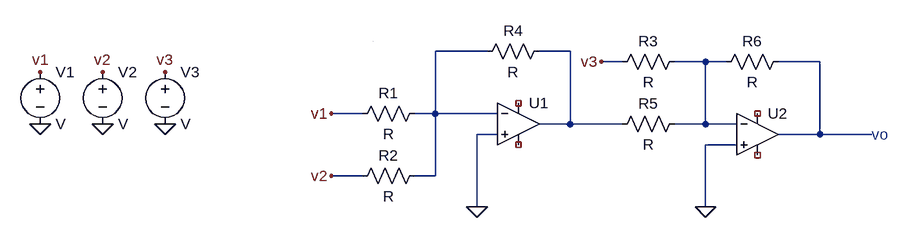
[diagram p0: schematic Q1 blank.asc]
Q1 blank.asc, the LTspice schematic file:
Version 4.1
SHEET 1 880 680
WIRE 176 16 96 16
WIRE 304 16 256 16
WIRE 384 32 352 32
WIRE 512 32 464 32
WIRE 544 32 512 32
WIRE 688 32 624 32
WIRE -16 112 -64 112
WIRE 96 112 96 16
WIRE 96 112 64 112
WIRE 192 112 96 112
WIRE 304 128 304 16
WIRE 304 128 256 128
WIRE 384 128 304 128
WIRE 512 128 512 32
WIRE 512 128 464 128
WIRE 560 128 512 128
WIRE 192 144 160 144
WIRE 688 144 688 32
WIRE 688 144 624 144
WIRE 768 144 688 144
WIRE 560 160 512 160
WIRE -16 208 -64 208
WIRE 96 208 96 112
WIRE 96 208 64 208
WIRE 160 256 160 144
WIRE 512 256 512 160
WIRE 0 0 0 0
FLAG -320 128 0
FLAG -416 128 0
FLAG -512 128 0
FLAG -512 48 v1
FLAG -64 112 v1
FLAG -416 48 v2
FLAG -64 208 v2
FLAG -320 48 v3
FLAG 352 32 v3
FLAG 160 256 0
FLAG 512 256 0
SYMBOL res 80 96 R90
WINDOW 0 0 56 VBottom 2
WINDOW 3 32 56 VTop 2
SYMATTR InstName R1
SYMBOL res 80 192 R90
WINDOW 0 0 56 VBottom 2
WINDOW 3 32 56 VTop 2
SYMATTR InstName R2
SYMBOL res 480 16 R90
WINDOW 0 0 56 VBottom 2
WINDOW 3 32 56 VTop 2
SYMATTR InstName R3
SYMBOL res 272 0 R90
WINDOW 0 0 56 VBottom 2
WINDOW 3 32 56 VTop 2
SYMATTR InstName R4
SYMBOL res 480 112 R90
WINDOW 0 0 56 VBottom 2
WINDOW 3 32 56 VTop 2
SYMATTR InstName R5
SYMBOL res 640 16 R90
WINDOW 0 0 56 VBottom 2
WINDOW 3 32 56 VTop 2
SYMATTR InstName R6
SYMBOL OpAmps\\UniversalOpAmp1 224 128 R0
SYMATTR InstName U1
SYMBOL OpAmps\\UniversalOpAmp1 592 144 R0
SYMATTR InstName U2
SYMBOL voltage -512 32 R0
SYMATTR InstName V1
SYMBOL voltage -416 32 R0
SYMATTR InstName V2
SYMBOL voltage -320 32 R0
SYMATTR InstName V3
TEXT 768 144 Left 2 ;vo

The netlist it stands for:
* Q1 blank.asc
R1 N001 v1 R
R2 N001 v2 R
R3 N003 v3 R
R4 N002 N001 R
R5 N003 N002 R
R6 N004 N003 R
X§U1 0 N001 NC_01 NC_02 N002 level1 Avol=1Meg GBW=10Meg Vos=0 En=0 Enk=0 In=0 Ink=0 Rin=500Meg  ; pins In+ In- V+ V- OUT
X§U2 0 N003 NC_03 NC_04 N004 level1 Avol=1Meg GBW=10Meg Vos=0 En=0 Enk=0 In=0 Ink=0 Rin=500Meg  ; pins In+ In- V+ V- OUT
V1 v1 0 V
V2 v2 0 V
V3 v3 0 V
* vo
.lib UniversalOpAmp1.lib
.backanno
.end